# Altium schematic sheet NRF.SchDoc
size A4
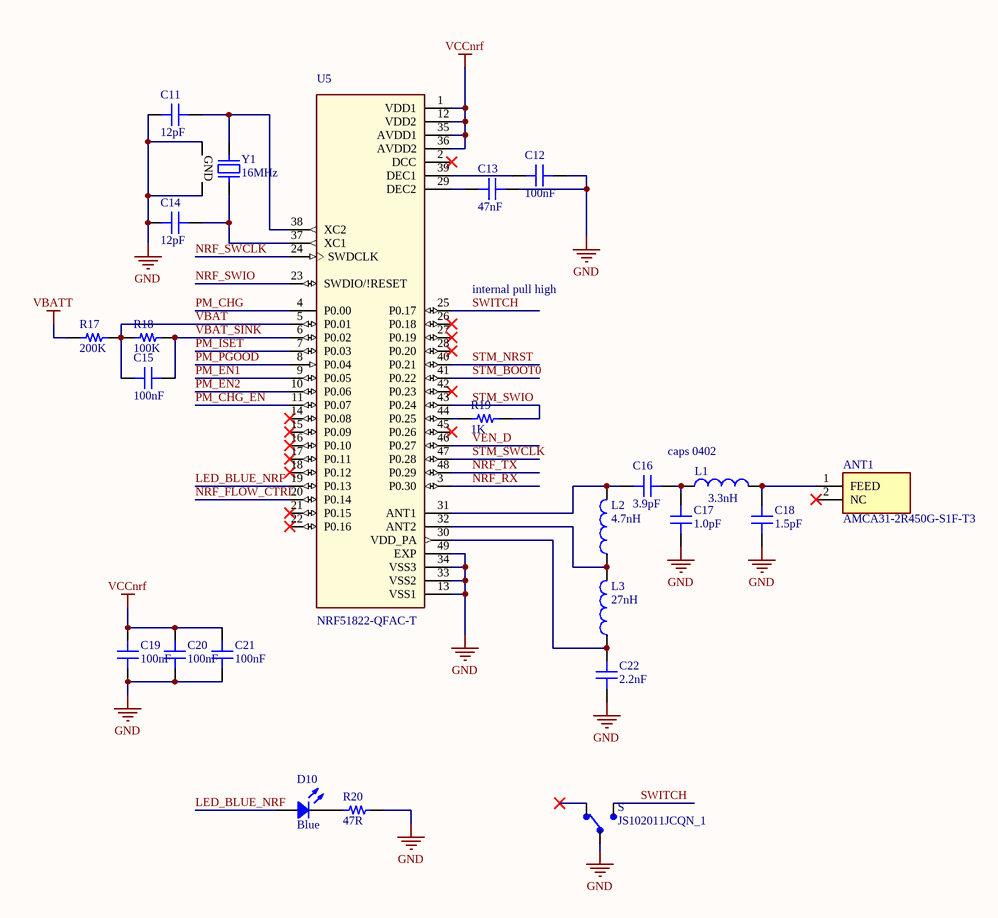
[diagram p0: NRF.SchDoc]

## Parts
ANT1  AMCA31-2R450G-S1F-T3  [ANTC3216X140N]
C11  12pF  [CAP 0402_1005]
C12  100nF  [CAP 0402_1005]
C13  47nF  [CAP 0402_1005]
C14  12pF  [CAP 0402_1005]
C15  100nF  [CAP 0402_1005]
C16  3.9pF  [CAP 0402_1005]
C17  1.0pF  [CAP 0402_1005]
C18  1.5pF  [CAP 0402_1005]
C19  100nF  [CAP 0402_1005]
C20  100nF  [CAP 0402_1005]
C21  100nF  [CAP 0402_1005]
C22  2.2nF  [CAP 0402_1005]
D10  Blue  [LED 0603_1608 BLUE]
L1  value 3.3nH  [0402-A]  (hidden comment: Inductor)
L2  value 4.7nH  [0402-A]  (hidden comment: Inductor)
L3  value 27nH  [0402-A]  (hidden comment: Inductor)
R17  200K  [RES 0402_1005]
R18  100K  [RES 0402_1005]
R19  1K  [RES 0402_1005]
R20  47R  [RES 0402_1005]
S  JS102011JCQN_1  [SW_JS102011JCQN]
U5  NRF51822-QFAC-T  [*QFN40P600X600X90-49N]
Y1  16MHz  [ABRACON ABM8G]

## Nets
GND: C11.1 C12.1 C13.1 C14.1 C17.1 C18.1 C19.1 C20.1 C21.1 C22.1 R20.2 S.2 U5.13(VSS1) U5.33(VSS2) U5.34(VSS3) U5.49(EXP) Y1.2(GND) Y1.4(GND)
VBATT: R17.1
VCCnrf: C19.2 C20.2 C21.2 U5.1(VDD1) U5.12(VDD2) U5.35(AVDD1) U5.36(AVDD2)
LED_BLUE_NRF: D10.1 U5.19(P0.13)
NRF_FLOW_CTRL: U5.20(P0.14)
NRF_RX: U5.3(P0.30)
NRF_SWCLK: U5.24(SWDCLK)
NRF_SWIO: U5.23(SWDIO/!RESET)
NRF_TX: U5.48(P0.29)
PM_CHG: U5.4(P0.00)
PM_CHG_EN: U5.11(P0.07)
PM_EN1: U5.9(P0.05)
PM_EN2: U5.10(P0.06)
PM_ISET: U5.7(P0.03)
PM_PGOOD: U5.8(P0.04)
STM_BOOT0: U5.41(P0.22)
STM_NRST: U5.40(P0.21)
STM_SWCLK: U5.47(P0.28)
STM_SWIO: R19.2 U5.43(P0.24)
SWITCH: S.3 U5.25(P0.17)
VBAT: C15.2 R17.2 R18.1 U5.5(P0.01)
VBAT_SINK: C15.1 R18.2 U5.6(P0.02)
VEN_D: U5.46(P0.27)
NetANT1_1: ANT1.1(FEED) C18.2 L1.2
NetC11_2: C11.2 U5.38(XC2) Y1.1
NetC12_2: C12.2 U5.39(DEC1)
NetC13_2: C13.2 U5.29(DEC2)
NetC14_2: C14.2 U5.37(XC1) Y1.3
NetC16_1: C16.1 L2.2 U5.31(ANT1)
NetC16_2: C16.2 C17.2 L1.1
NetC22_2: C22.2 L3.1 U5.30(VDD_PA)
NetD10_2: D10.2 R20.1
NetL2_1: L2.1 L3.2 U5.32(ANT2)
NetR19_1: R19.1 U5.44(P0.25)

Not connected (* = marked no-connect by the designer): ANT1 2(NC)*; S 1*; U5 2(DCC)* 14(P0.08)* 15(P0.09)* 16(P0.10)* 17(P0.11)* 18(P0.12)* 21(P0.15)* 22(P0.16)* 26(P0.18)* 27(P0.19)* 28(P0.20)* 42(P0.23)* 45(P0.26)*

## Notes on the sheet
- (near U5) internal pull high
- caps 0402

## Library data of the parts
ANT1 = AMCA31-2R450G-S1F-T3: Antenna; Manufacturer_Name: ABRACON; Datasheet Link: http://www.abracon.com/chip-antenna/AMCA31-2R450G-S1F-T.pdf; Height: 1.4mm; Manufacturer_Part_Number: AMCA31-2R450G-S1F-T3; Arrow Part Number: AMCA31-2R450G-S1F-T3; Arrow Price/Stock: https://www.arrow.com/en/products/amca31-2r450g-s1f-t3/abracon; Mouser Part Number: 815-CA312R450GS1FT3; Mouser Price/Stock: https://www.mouser.co.uk/ProductDetail/ABRACON/AMCA31-2R450G-S1F-T3?qs=AAveGqk956GLuOddQEK40Q%3D%3D
C11 C14 = 04025A120GAT2A: CAP CER 12PF 50V C0G/NP0 0402; Manufacturer: AVX Corporation; Temperature Coefficient: C0G, NP0; Tolerance: ±2%; Part Number: 04025A120GAT2A; Value: 12pF; Applications: General Purpose; Capacitance: 12pF; ComponentLink1Description: Datasheet; ComponentLink1URL: http://datasheets.avx.com/C0GNP0-Dielectric.pdf; ComponentLink2Description: DigiKey Link; ComponentLink2URL: http://digikey.com/product-detail/en/avx-corporation/04025A120GAT2A/478-7871-1-ND/3881494; Device Package: 0402 (1005 Metric); LastUpdated: 4/1/2020 11:57:05 PM; Lifecycle Status: Active; Minimum Order: 1; Mounting Type: Surface Mount, MLCC; Operating Temperature: -55°C ~ 125°C; Package / Case: 0402 (1005 Metric); Packaging: TapeAndReel; PartId: 1768; Part Status: Active; Price: 0.12; Series: -; Size / Dimension: 0.039" L x 0.020" W (1.00mm x 0.50mm); Supplier 1: DigiKey; Supplier Part Number 1: 478-7871-1-ND; Thickness (Max): 0.022" (0.55mm); Voltage - Rated: 50V
C12 C13 C15-C22 = C0402C104M4VACTU: CAP CER 0.1UF 16V Y5V 0402; Manufacturer: KEMET; Capacitance: 0.1µF; Temperature Coefficient: Y5V (F); Tolerance: ±20%; Part Number: C0402C104M4VACTU; Applications: General Purpose; ComponentLink1Description: Datasheet; ComponentLink1URL: //media.digikey.com/PDF/Data%20Sheets/Kemet%20PDFs/COG%20Dielectric.pdf; ComponentLink2Description: DigiKey Link; ComponentLink2URL: http://digikey.com/product-detail/en/kemet/C0402C104M4VACTU/399-7332-1-ND/3316949; Device Package: 0402 (1005 Metric); LastUpdated: 4/1/2020 11:57:05 PM; Lifecycle Status: Active; Minimum Order: 1; Mounting Type: Surface Mount, MLCC; Operating Temperature: -30°C ~ 85°C; Package / Case: 0402 (1005 Metric); Packaging: TapeAndReel; PartId: 1738; Part Status: Active; Price: 0.08; Series: SMD Comm Y5V; Size / Dimension: 0.039" L x 0.020" W (1.00mm x 0.50mm); Supplier 1: DigiKey; Supplier Part Number 1: 399-7332-1-ND; Thickness (Max): 0.022" (0.55mm); Voltage - Rated: 16V
  C12 C15 C19-C21: Value: 100nF
  C13: Value: 47nF
  C16: Value: 3.9pF
  C17: Value: 1.0pF
  C18: Value: 1.5pF
  C22: Value: 2.2nF
D10 = XZFBB53W-1: LED BLUE CLEAR 2SMD; Manufacturer: SunLED; Configuration: Standard; Current - Test: 20mA; Lens Color: Colorless; Lens Size: 1.20mm x 0.80mm; Lens Style: Rectangle with Flat Top; Millicandela Rating: 178mcd; Viewing Angle: 130°; Voltage - Forward (Vf) (Typ): 3.3V; Wavelength - Dominant: 470nm; Wavelength - Peak: 465nm; Part Number: XZFBB53W-1; Color: Blue; ComponentLink1Description: Datasheet; ComponentLink1URL: https://www.sunledusa.com/products/spec/XZFBB53W-1.pdf; ComponentLink2Description: DigiKey Link; ComponentLink2URL: http://digikey.com/product-detail/en/sunled/XZFBB53W-1/1497-1310-1-ND/6615742; Device Package: 0603 (1608 Metric); Height (Max): 0.85mm; LastUpdated: 1/21/2020 3:11:01 AM; Lens Transparency: Clear; Lifecycle Status: Active; Minimum Order: 1; Mounting Type: Surface Mount; Package / Case: 0603 (1608 Metric); Packaging: TapeAndReel; PartId: 782; Part Status: Active; Price: 0.15; Series: -; Size / Dimension: 1.60mm L x 0.80mm W; Supplier 1: DigiKey; Supplier Part Number 1: 1497-1310-1-ND; Supplier Device Package: 2-SMD; Value: Blue
L1-L3 = Inductor: Code_IEC: 1005; Published: 8-Jun-2000; LatestRevisionDate: 29-May-2009; LatestRevisionNote: IPC-7351 Footprint Added.; PackageReference: 0402-A; Publisher: Altium Limited; PackageDescription: Chip Inductor; Code_JEITA: 0402
R17-R20 = RT0402FRE074K7L: RES SMD 4.7K OHM 1% 1/16W 0402; Manufacturer: Yageo; Power (Watts): 0.063W, 1/16W; Resistance: 4.7 kOhms; Temperature Coefficient: ±50ppm/°C; Part Number: RT0402FRE074K7L; ComponentLink1Description: Datasheet; ComponentLink1URL: https://www.yageo.com/upload/media/product/productsearch/datasheet/rchip/PYu-RT_1-to-0.01_RoHS_L_11.pdf; ComponentLink2Description: DigiKey Link; ComponentLink2URL: http://digikey.com/product-detail/en/yageo/RT0402FRE074K7L/YAG3347CT-ND/5418052; Composition: Thin Film; Device Package: 0402 (1005 Metric); Height - Seated (Max): 0.014" (0.35mm); LastUpdated: 1/21/2020 12:06:02 AM; Lifecycle Status: Active; Minimum Order: 1; Number of Terminations: 2; Operating Temperature: -55°C ~ 155°C; Package / Case: 0402 (1005 Metric); Packaging: TapeAndReel; PartId: 3198; Part Status: Active; Price: 0.01; Series: RT; Size / Dimension: 0.039" L x 0.020" W (1.00mm x 0.50mm); Supplier 1: DigiKey; Supplier Part Number 1: YAG3347CT-ND; Supplier Device Package: 0402; Tolerance: ±1%
  R17: Value: 200K
  R18: Value: 100K
  R19: Value: 1K
  R20: Value: 47R
S = JS102011JCQN_1: Slide Switch SPDT Surface Mount; MF: C&K; Package: None; Price: None; Availability: Unavailable; MP: JS102011JCQN; SnapEDA_Link: https://www.snapeda.com/parts/JS102011JCQN/C%26K/view-part/595990/?ref=snap; Value: *
Y1 = ABM8G-16.000MHZ-B4Y-T: CRYSTAL 16.0000MHZ 10PF SMD; Manufacturer: Abracon LLC; ESR (Equivalent Series Resistance): 80 Ohms; Frequency Stability: ±30ppm; Operating Mode: Fundamental; Part Number: ABM8G-16.000MHZ-B4Y-T; ComponentLink1Description: Datasheet; ComponentLink1URL: https://abracon.com/Resonators/ABM8G.pdf; ComponentLink2Description: DigiKey Link; ComponentLink2URL: http://digikey.com/product-detail/en/abracon-llc/ABM8G-16.000MHZ-B4Y-T/535-10289-1-ND/2218102; Device Package: 4-SMD, No Lead; Frequency: 16MHz; Frequency Tolerance: ±30ppm; Height - Seated (Max): 0.039" (1.00mm); LastUpdated: 3/19/2020 10:36:25 PM; Lifecycle Status: Active; Load Capacitance: 10pF; Minimum Order: 1; Mounting Type: Surface Mount; Operating Temperature: -20°C ~ 70°C; Package / Case: 4-SMD, No Lead; Packaging: TapeAndReel; PartId: 302; Part Status: Active; Price: 0.50; Series: ABM8G; Size / Dimension: 0.126" L x 0.098" W (3.20mm x 2.50mm); Supplier 1: DigiKey; Supplier Part Number 1: 535-10289-1-ND; Type: MHz Crystal; Value: 16MHz
U5 = NRF51822-QFAC-T: SnapEDA_Link: https://www.snapeda.com/parts/NRF51822-QFAC-T/Nordic%20Semiconductor%20ASA/view-part/50058/?ref=snap; Value: *